# Altium schematic sheet ESP8266.SchDoc
size A4; SheetNumber: 3
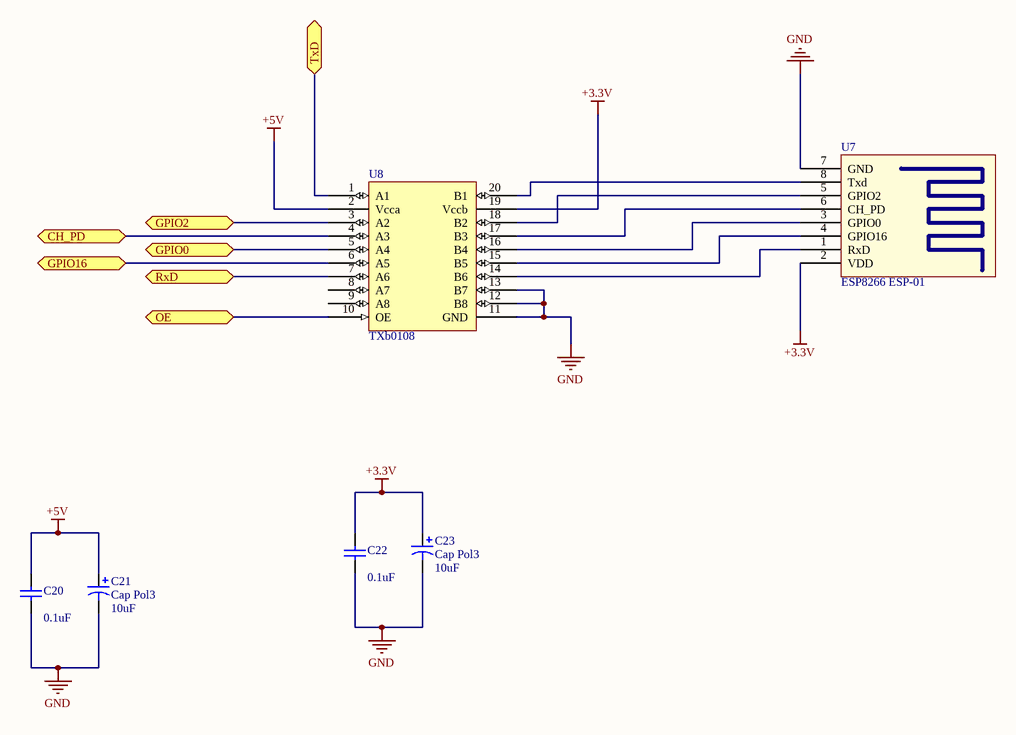
[diagram p0: ESP8266.SchDoc]

## Parts
C20  value 0.1uF  [C1206]  (hidden comment: Cap Semi)
C21  Cap Pol3  value 10uF  [C0805]
C22  value 0.1uF  [C1206]  (hidden comment: Cap Semi)
C23  Cap Pol3  value 10uF  [C0805]
U7  ESP8266 ESP-01  [ESP8266 ESP-01]
U8  TXb0108  [TXB0108]

## Ports
CH_PD, GPIO0, GPIO2, GPIO16, OE, RxD, TxD

## Nets
+3.3V: C22.1 C23.1 U7.2(VDD) U8.19(Vccb)
+5V: C20.1 C21.1 U8.2(Vcca)
GND: C20.2 C21.2 C22.2 C23.2 U7.7(GND) U8.11(GND) U8.12(B8) U8.13(B7)
CH_PD: U8.4(A3) ; port CH_PD
GPIO0: U8.5(A4) ; port GPIO0
GPIO2: U8.3(A2) ; port GPIO2
GPIO16: U8.6(A5) ; port GPIO16
OE: U8.10(OE) ; port OE
RxD: U8.7(A6) ; port RxD
TxD: U8.1(A1) ; port TxD
NetU7_1: U7.1(RxD) U8.14(B6)
NetU7_3: U7.3(GPIO0) U8.16(B4)
NetU7_4: U7.4(GPIO16) U8.15(B5)
NetU7_5: U7.5(GPIO2) U8.18(B2)
NetU7_6: U7.6(CH_PD) U8.17(B3)
NetU7_8: U7.8(Txd) U8.20(B1)

Not connected (* = marked no-connect by the designer): U8 8(A7) 9(A8)

## Library data of the parts
C20 C22 = Cap Semi: Capacitor (Semiconductor SIM Model); Published: 8-Jun-2000; LatestRevisionDate: 29-May-2009; LatestRevisionNote: IPC-7351 Footprint Added.; PackageReference: C1206; Publisher: Altium Limited; PackageDescription: Chip Capacitor
C21 C23 = Cap Pol3: Polarized Capacitor (Surface Mount); Published: 8-Jun-2000; LatestRevisionDate: 29-May-2009; LatestRevisionNote: IPC-7351 Footprint Added.; PackageReference: C0805; Publisher: Altium Limited; PackageDescription: Chip Capacitor